# EAGLE design MODULO0 (EAGLE 7.1.0)
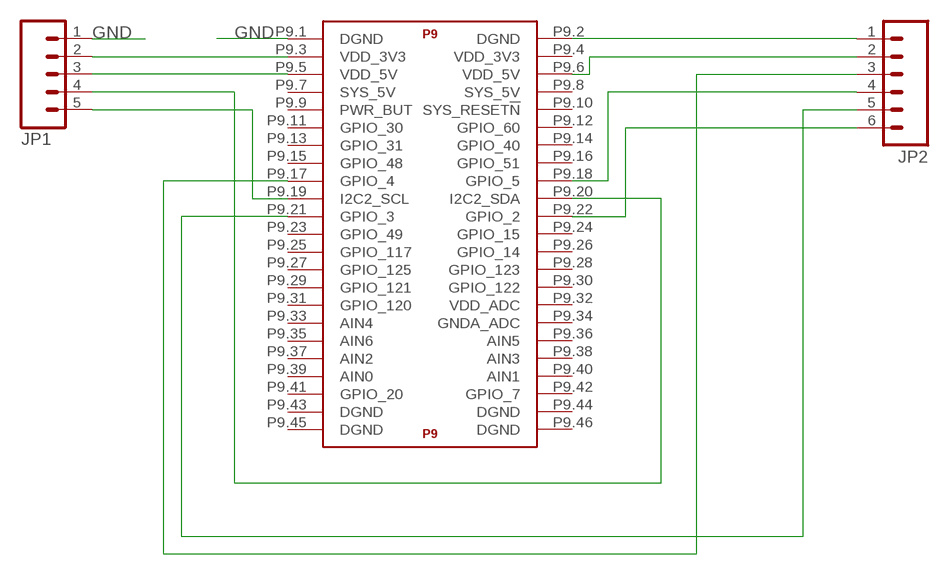
[diagram p0: schematic, sheet 1]

## Parts
JP1  M05PTH  [1X05]
JP2  M06SILK_FEMALE_PTH  [1X06]
U$1  BEAGLE_BONE_BLACK_CAPE  [BEAGLE_BONE_BLACK_CAPE]

## Nets
GND: JP1.1 U$1.P9.1(P9:DGND)
N$2: JP1.2 U$1.P9.3(P9:VDD_3V3)
N$3: JP1.3 U$1.P9.5(P9:VDD_5V)
N$4: JP1.5 U$1.P9.19(P9:I2C2_SCL)
N$5: JP1.4 U$1.P9.20(P9:I2C2_SDA)
N$6: JP2.1 U$1.P9.2(P9:DGND)
N$7: JP2.2 U$1.P9.6(P9:VDD_5V)
N$8: JP2.3 U$1.P9.17(P9:GPIO_4)
N$9: JP2.4 U$1.P9.18(P9:GPIO_5)
N$10: JP2.6 U$1.P9.22(P9:GPIO_2)
N$11: JP2.5 U$1.P9.21(P9:GPIO_3)
Unconnected: U$1.P8.1(P8:DGND) U$1.P8.2(P8:DGND) U$1.P8.3(P8:GPIO_38) U$1.P8.4(P8:GPIO_39) U$1.P8.5(P8:GPIO_34) U$1.P8.6(P8:GPIO_35) U$1.P8.7(P8:GPIO_66) U$1.P8.8(P8:GPIO_67) U$1.P8.9(P8:GPIO_69) U$1.P8.10(P8:GPIO_68) U$1.P8.11(P8:GPIO_45) U$1.P8.12(P8:GPIO_44) U$1.P8.13(P8:GPIO_23) U$1.P8.14(P8:GPIO_26) U$1.P8.15(P8:GPIO_47) U$1.P8.16(P8:GPIO_46) U$1.P8.17(P8:GPIO_27) U$1.P8.18(P8:GPIO_65) U$1.P8.19(P8:GPIO_22) U$1.P8.20(P8:GPIO_63) U$1.P8.21(P8:GPIO_62) U$1.P8.22(P8:GPIO_37) U$1.P8.23(P8:GPIO_36) U$1.P8.24(P8:GPIO_33) U$1.P8.25(P8:GPIO_32) U$1.P8.26(P8:GPIO_61) U$1.P8.27(P8:GPIO_86) U$1.P8.28(P8:GPIO_88) U$1.P8.29(P8:GPIO_87) U$1.P8.30(P8:GPIO_89) U$1.P8.31(P8:GPIO_10) U$1.P8.32(P8:GPIO_11) U$1.P8.33(P8:GPIO_9) U$1.P8.34(P8:GPIO_81) U$1.P8.35(P8:GPIO_8) U$1.P8.36(P8:GPIO_80) U$1.P8.37(P8:GPIO_78) U$1.P8.38(P8:GPIO_79) U$1.P8.39(P8:GPIO_76) U$1.P8.40(P8:GPIO_77) U$1.P8.41(P8:GPIO_74) U$1.P8.42(P8:GPIO_75) U$1.P8.43(P8:GPIO_72) U$1.P8.44(P8:GPIO_73) U$1.P8.45(P8:GPIO_70) U$1.P8.46(P8:GPIO_71) U$1.P9.4(P9:VDD_3V3) U$1.P9.7(P9:SYS_5V) U$1.P9.8(P9:SYS_5V) U$1.P9.9(P9:PWR_BUT) U$1.P9.10(P9:SYS_RESET!N) U$1.P9.11(P9:GPIO_30) U$1.P9.12(P9:GPIO_60) U$1.P9.13(P9:GPIO_31) U$1.P9.14(P9:GPIO_40) U$1.P9.15(P9:GPIO_48) U$1.P9.16(P9:GPIO_51) U$1.P9.23(P9:GPIO_49) U$1.P9.24(P9:GPIO_15) U$1.P9.25(P9:GPIO_117) U$1.P9.26(P9:GPIO_14) U$1.P9.27(P9:GPIO_125) U$1.P9.28(P9:GPIO_123) U$1.P9.29(P9:GPIO_121) U$1.P9.30(P9:GPIO_122) U$1.P9.31(P9:GPIO_120) U$1.P9.32(P9:VDD_ADC) U$1.P9.33(P9:AIN4) U$1.P9.34(P9:GNDA_ADC) U$1.P9.35(P9:AIN6) U$1.P9.36(P9:AIN5) U$1.P9.37(P9:AIN2) U$1.P9.38(P9:AIN3) U$1.P9.39(P9:AIN0) U$1.P9.40(P9:AIN1) U$1.P9.41(P9:GPIO_20) U$1.P9.42(P9:GPIO_7) U$1.P9.43(P9:DGND) U$1.P9.44(P9:DGND) U$1.P9.45(P9:DGND) U$1.P9.46(P9:DGND)

## Library data of the parts
JP1 = SparkFun-Connectors:M05: Header 5 Standard 5-pin 0.1" header. Use with straight break away headers (SKU : PRT-00116), right angle break away headers (PRT-00553), swiss pins (PRT-00743), machine pins (PRT-00117), and female headers (PRT-00115). Molex polarized connector foot print use with SKU : PRT-08230 with associated crimp pins and housings.
JP2 = SparkFun-Connectors:M06: Header 6 Standard 6-pin 0.1" header. Use with straight break away headers (SKU : PRT-00116), right angle break away headers (PRT-00553), swiss pins (PRT-00743), machine pins (PRT-00117), and female headers (PRT-00115). Molex polarized connector foot print use with SKU : PRT-08094 with associated crimp pins and housings. NOTES ON THE VARIANTS LOCK and LOCK_LONGPADS... This footprint was designed to help hold the alignment of a through-hole component (i.e. 6-pin header) while soldering it into place. You may notice that each hole has been shifted either up or down by 0.005 of an inch from it's more standard position (which is a perfectly straight line). This slight alteration caused the pins (the squares in the middle) to touch the edges of the holes. Because they are alternating, it causes a "brace" to hold the component in place. 0.005 has proven to be the perfect amount of "off-center" position when using our standard breakaway headers. Although looks a little odd when you look at the bare footprint, once you have a header in there, the alteration is very hard to notice. Also,if you push a header all the way into place, it is covered up entirely on the bottom side. This idea of altering the position of holes to aid alignment will be further integrated into the Sparkfun Library for other footprints. It can help hold any component with 3 or more connection pins.; PROD_ID: CONN-08437
U$1 = SparkFun-Boards:BEAGLE_BONE_BLACK_CAPE

## Board
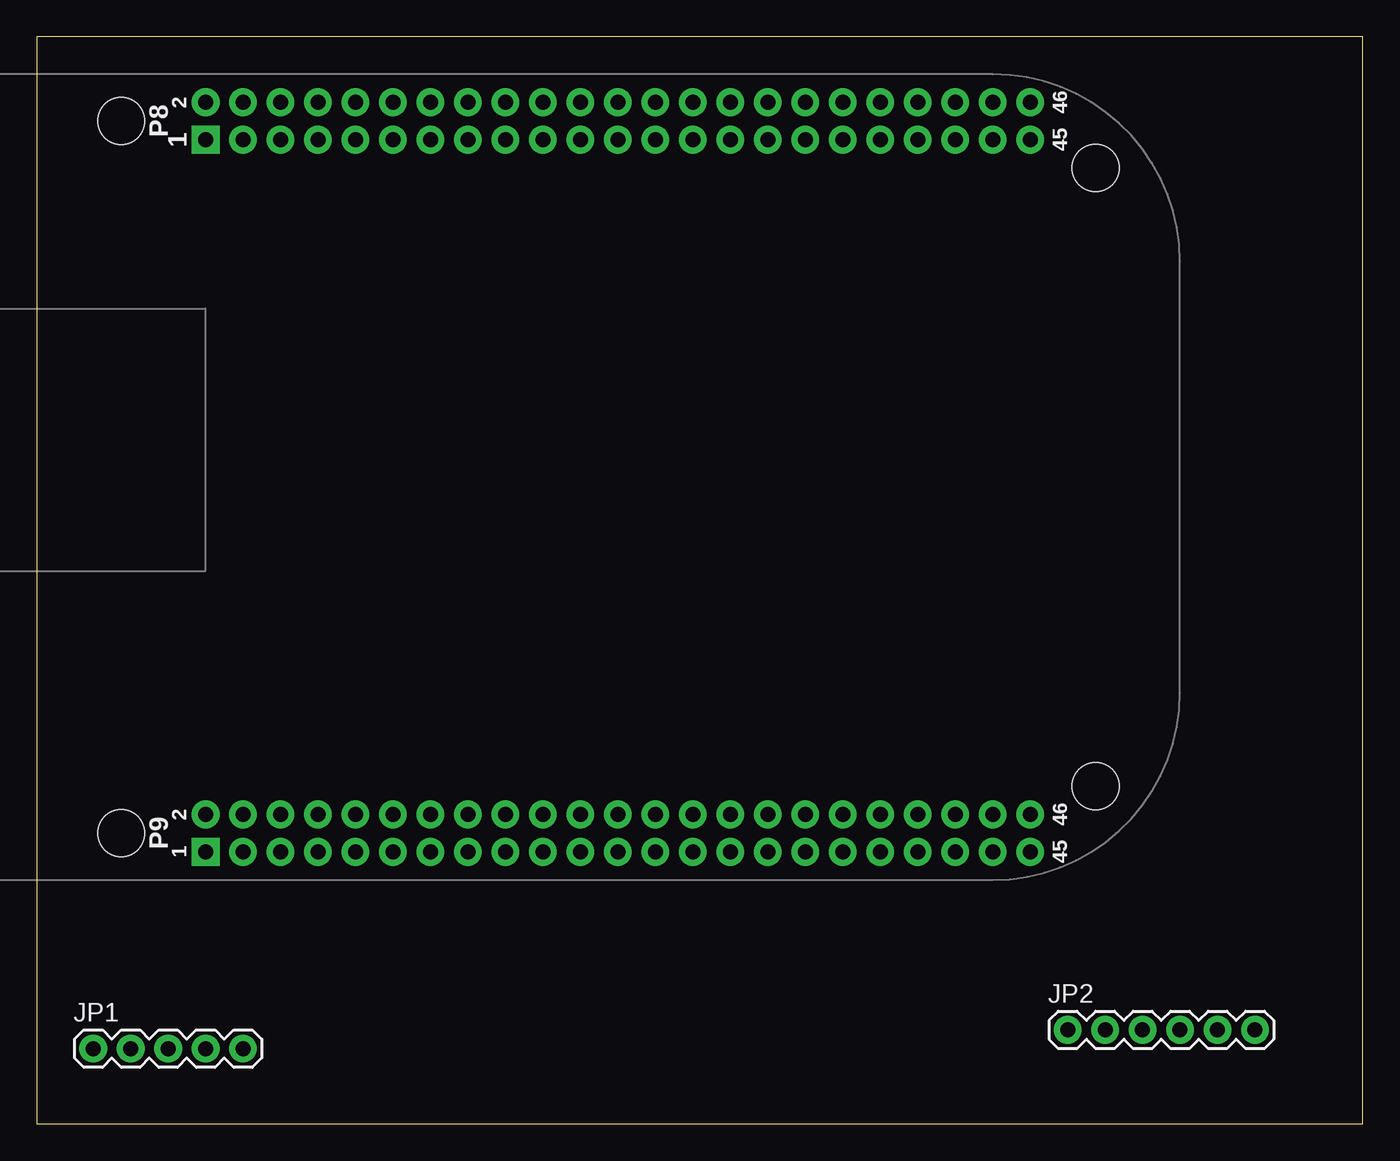
[diagram p1: board, top side]
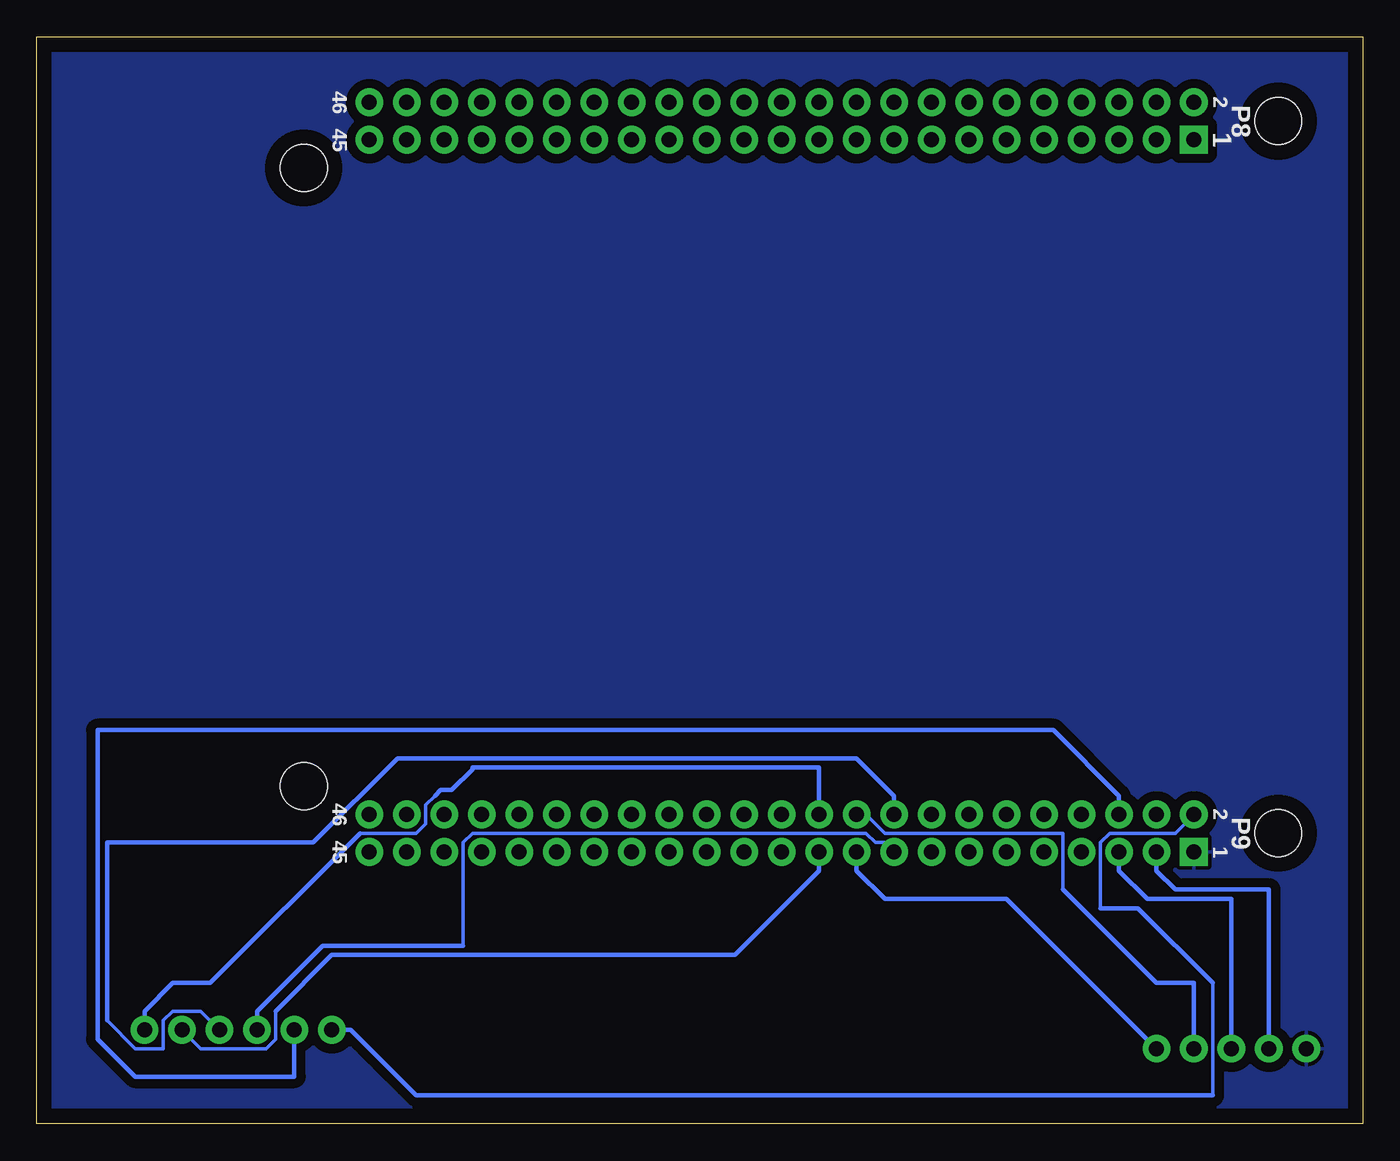
[diagram p2: board, bottom side, seen from below]

Size 89.84 x 73.65 mm. Coordinates in mm from the lower left corner, seen from the top.
Outline: 0,0 89.84,0 89.84,73.65 0,73.65 0,0
Copper layers (1*16): Top 0.035mm / dielectric 1.5mm / Bottom 0.035mm
Design rules "default *": minimum track width 12mil, minimum drill 24mil, track to track 11mil, track to pad 8mil, pad to pad 8mil, via to via 8mil, smd to smd 8mil, copper to edge 40mil, drill to drill 8mil, minimum pad ring 10mil, minimum via ring 8mil, stop-mask expansion 4mil, vias tented up to drill 0mil, thermal gap 10mil

### Footprints (pad centres in the part's own frame; a part is rotated, then mirrored left to right if it is on the bottom)
1X05 = drill 1.016 pad 1.88: 1 0,0; 2 2.54,0; 3 5.08,0; 4 7.62,0; 5 10.16,0
1X06 = drill 1.016 pad 1.88: 1 0,0; 2 2.54,0; 3 5.08,0; 4 7.62,0; 5 10.16,0; 6 12.7,0
BEAGLE_BONE_BLACK_CAPE = drill 1.016 pad 1.88 square: P8.1 20.32,50.165; P9.1 20.32,1.905 | drill 1.016 pad 1.88: P8.2 20.32,52.705; P8.3 22.86,50.165; P8.4 22.86,52.705; P8.5 25.4,50.165; P8.6 25.4,52.705; P8.7 27.94,50.165; P8.8 27.94,52.705; P8.9 30.48,50.165; P8.10 30.48,52.705; P8.11 33.02,50.165; P8.12 33.02,52.705; P8.13 35.56,50.165; P8.14 35.56,52.705; P8.15 38.1,50.165; P8.16 38.1,52.705; P8.17 40.64,50.165; P8.18 40.64,52.705; P8.19 43.18,50.165; P8.20 43.18,52.705; P8.21 45.72,50.165; P8.22 45.72,52.705; P8.23 48.26,50.165; P8.24 48.26,52.705; P8.25 50.8,50.165; P8.26 50.8,52.705; P8.27 53.34,50.165; P8.28 53.34,52.705; P8.29 55.88,50.165; P8.30 55.88,52.705; P8.31 58.42,50.165; P8.32 58.42,52.705; P8.33 60.96,50.165; P8.34 60.96,52.705; P8.35 63.5,50.165; P8.36 63.5,52.705; P8.37 66.04,50.165; P8.38 66.04,52.705; P8.39 68.58,50.165; P8.40 68.58,52.705; P8.41 71.12,50.165; P8.42 71.12,52.705; P8.43 73.66,50.165; P8.44 73.66,52.705; P8.45 76.2,50.165; P8.46 76.2,52.705; P9.2 20.32,4.445; P9.3 22.86,1.905; P9.4 22.86,4.445; P9.5 25.4,1.905; P9.6 25.4,4.445; P9.7 27.94,1.905; P9.8 27.94,4.445; P9.9 30.48,1.905; P9.10 30.48,4.445; P9.11 33.02,1.905; P9.12 33.02,4.445; P9.13 35.56,1.905; P9.14 35.56,4.445; P9.15 38.1,1.905; P9.16 38.1,4.445; P9.17 40.64,1.905; P9.18 40.64,4.445; P9.19 43.18,1.905; P9.20 43.18,4.445; P9.21 45.72,1.905; P9.22 45.72,4.445; P9.23 48.26,1.905; P9.24 48.26,4.445; P9.25 50.8,1.905; P9.26 50.8,4.445; P9.27 53.34,1.905; P9.28 53.34,4.445; P9.29 55.88,1.905; P9.30 55.88,4.445; P9.31 58.42,1.905; P9.32 58.42,4.445; P9.33 60.96,1.905; P9.34 60.96,4.445; P9.35 63.5,1.905; P9.36 63.5,4.445; P9.37 66.04,1.905; P9.38 66.04,4.445; P9.39 68.58,1.905; P9.40 68.58,4.445; P9.41 71.12,1.905; P9.42 71.12,4.445; P9.43 73.66,1.905; P9.44 73.66,4.445; P9.45 76.2,1.905; P9.46 76.2,4.445 | hole 3.175: 14.605,3.175; 80.645,6.35; 80.645,48.26; 14.605,51.435

### Placement (x,y rotation side)
JP1  3.81,5.08 0 top
JP2  69.85,6.35 0 top
U$1  -8.89,16.51 0 top

### Tracks (layer width: path | path; a pad name or v marks a point on that pad's centre or on a via)
GND
  pour Bottom (isolate 0.635): 0,73.66 89.92,73.41 89.92,0 0,0
N$2
  Bottom 0.305: JP1.2 6.35,15.88 12.7,15.88 13.97,17.14 U$1.P9.3
N$3
  Bottom 0.305: JP1.3 8.89,15.24 14.61,15.24 16.51,17.14 U$1.P9.5
N$4
  Bottom 0.305: JP1.5 24.13,15.24 32.38,15.24 34.29,17.14 U$1.P9.19
N$5
  Bottom 0.254: 20.32,15.88 20.32,19.68 32.38,19.68 33.66,20.95 U$1.P9.20
  Bottom 0.305: JP1.4 11.43,9.53 13.97,9.53 20.32,15.88
N$6
  Bottom 0.254: U$1.P9.2 12.7,19.68 17.14,19.68 17.78,19.05 17.78,14.61 | 10.16,1.91 10.16,9.53
  Bottom 0.305: 17.78,14.61 15.24,14.61 10.16,9.53 | 10.16,1.91 64.14,1.91 68.58,6.35 JP2.1
N$7
  Bottom 0.305: JP2.2 72.39,3.17 83.19,3.17 85.72,5.71 85.72,26.67 20.95,26.67 16.51,22.23 U$1.P9.6
N$8
  Bottom 0.254: U$1.P9.17 32.38,19.05 33.02,19.05 33.66,19.68 60.33,19.68 60.96,19.05 60.96,12.06
  Bottom 0.305: 60.96,12.06 70.48,12.06 74.93,7.62 JP2.3
N$9
  Bottom 0.254: JP2.4 78.74,7.62 80.64,7.62 81.28,6.99 81.28,5.08 83.19,5.08 85.09,6.99
  Bottom 0.305: 85.09,6.99 85.09,19.05 71.12,19.05 65.41,24.77 34.29,24.77 31.75,22.23 U$1.P9.18
N$10
  Bottom 0.254: 62.87,22.23 63.5,21.59 63.5,20.32 64.14,19.68 67.94,19.68
  Bottom 0.305: U$1.P9.22 36.83,24.13 60.33,24.13 60.33,24 61.72,22.61 62.48,22.61 62.87,22.23 | 67.94,19.68 78.11,9.53 80.64,9.53 82.55,7.62 JP2.6
N$11
  Bottom 0.254: JP2.5 78.74,5.08 74.3,5.08 73.66,5.71 73.66,7.62
  Bottom 0.305: 73.66,7.62 69.85,11.43 42.55,11.43 36.83,17.14 U$1.P9.21